# EAGLE design main2 (EAGLE 7.4.0)
Line-Tracking Robot Project
DATE: 2015/09/23; DESIGNER: iPAS; PROJECT: Line-Tracking Robot
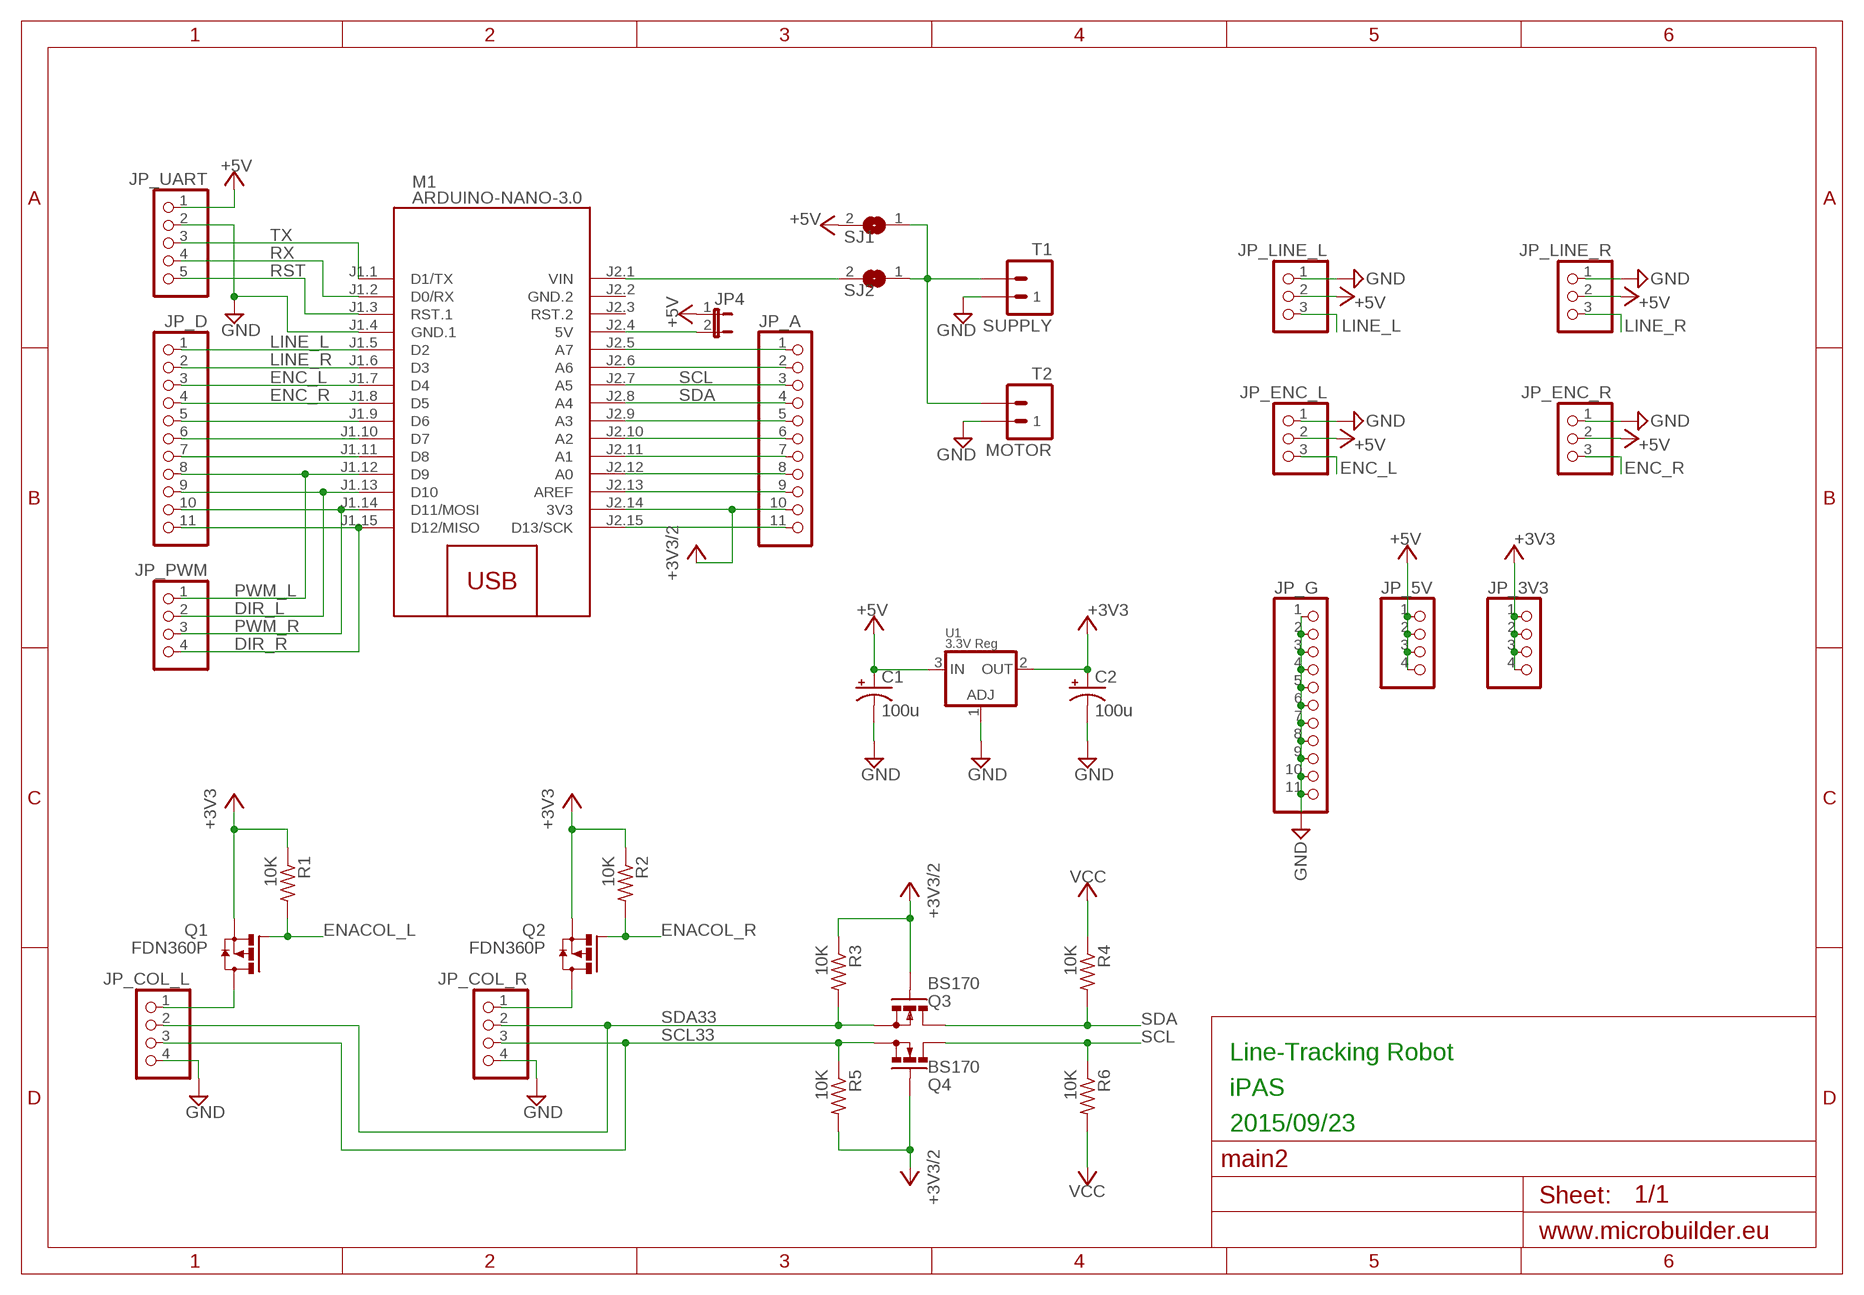
[diagram p0: schematic, sheet 1]

## Parts
C1  100u  RCL_CPOL-USE2.5-6  [RCL_E2,5-6]
C2  100u  RCL_CPOL-USE2.5-6  [RCL_E2,5-6]
JP4  JUMPER2  [JUMPER2]
JP_3V3  HEADER-1X4ROUND  [1X04_ROUND]
JP_5V  HEADER-1X4ROUND  [1X04_ROUND]
JP_A  HEADER-1X11  [1X11_ROUND]
JP_COL_L  HEADER-1X4ROUND  [1X04_ROUND]
JP_COL_R  HEADER-1X4ROUND  [1X04_ROUND]
JP_D  HEADER-1X11  [1X11_ROUND]
JP_ENC_L  HEADER-1X3ROUND  [1X03_ROUND]
JP_ENC_R  HEADER-1X3ROUND  [1X03_ROUND]
JP_G  HEADER-1X11  [1X11_ROUND]
JP_LINE_L  HEADER-1X3ROUND  [1X03_ROUND]
JP_LINE_R  HEADER-1X3ROUND  [1X03_ROUND]
JP_PWM  HEADER-1X4ROUND  [1X04_ROUND]
JP_UART  HEADER-1X5ROUND  [1X05_ROUND]
M1  ARDUINO-NANO-3.0  [ARDUINO-NANO-3.0]
Q1  FDN360P  [SUPER-SOT3]
Q2  FDN360P  [SUPER-SOT3]
Q3  BS170  [TO92-]
Q4  BS170  [TO92-]
R1  10K  RCL_R-US0204/5  [RCL_0204/5]
R2  10K  RCL_R-US0204/5  [RCL_0204/5]
R3  10K  RCL_R-US0204/5  [RCL_0204/5]
R4  10K  RCL_R-US0204/5  [RCL_0204/5]
R5  10K  RCL_R-US0204/5  [RCL_0204/5]
R6  10K  RCL_R-US0204/5  [RCL_0204/5]
SJ1  SOLDERJUMPERREFLOW  [SOLDERJUMPER_REFLOW]
SJ2  SOLDERJUMPERREFLOW  [SOLDERJUMPER_REFLOW]
T1  SUPPLY  ST02-3.81MM  [DG381-02P]
T2  MOTOR  ST02-3.81MM  [DG381-02P]
U1  3.3V Reg  LM1117SOT223-REFLOW  [SOT223-R]

## Nets
+3V3: C2.+ JP_3V3.1 JP_3V3.2 JP_3V3.3 JP_3V3.4 Q1.2(S) Q2.2(S) R1.1 R2.1 U1.2(OUT)
+3V3/2: JP_A.10 M1.J2.14(3V3) Q3.2(G) Q4.2(G) R3.1 R5.2
+5V: C1.+ JP4.1 JP_5V.1 JP_5V.2 JP_5V.3 JP_5V.4 JP_ENC_L.2 JP_ENC_R.2 JP_LINE_L.2 JP_LINE_R.2 JP_UART.1 SJ1.2 U1.3(IN)
DIR_L: JP_D.9 JP_PWM.2 M1.J1.13(D10)
DIR_R: JP_D.11 JP_PWM.4 M1.J1.15(D12/MISO)
ENACOL_L: Q1.1(G) R1.2
ENACOL_R: Q2.1(G) R2.2
ENC_L: JP_D.3 JP_ENC_L.3 M1.J1.7(D4)
ENC_R: JP_D.4 JP_ENC_R.3 M1.J1.8(D5)
GND: C1.- C2.- JP_COL_L.4 JP_COL_R.4 JP_ENC_L.1 JP_ENC_R.1 JP_G.1 JP_G.2 JP_G.3 JP_G.4 JP_G.5 JP_G.6 JP_G.7 JP_G.8 JP_G.9 JP_G.10 JP_G.11 JP_LINE_L.1 JP_LINE_R.1 JP_UART.2 M1.J1.4(GND.1) T1.1 T2.1 U1.1(ADJ)
LINE_L: JP_D.1 JP_LINE_L.3 M1.J1.5(D2)
LINE_R: JP_D.2 JP_LINE_R.3 M1.J1.6(D3)
N$1: JP_COL_R.1 Q2.3(D)
N$2: JP_A.1 M1.J2.5(A7)
N$3: JP_COL_L.1 Q1.3(D)
N$4: JP_A.2 M1.J2.6(A6)
N$5: JP4.2 M1.J2.4(5V)
N$6: M1.J2.1(VIN) SJ2.2
N$7: SJ1.1 SJ2.1 T1.2 T2.2
N$9: JP_D.5 M1.J1.9(D6)
N$10: JP_D.6 M1.J1.10(D7)
N$11: JP_D.7 M1.J1.11(D8)
N$18: JP_A.5 M1.J2.9(A3)
N$19: JP_A.6 M1.J2.10(A2)
N$20: JP_A.7 M1.J2.11(A1)
N$21: JP_A.8 M1.J2.12(A0)
N$22: JP_A.9 M1.J2.13(AREF)
N$24: JP_A.11 M1.J2.15(D13/SCK)
PWM_L: JP_D.8 JP_PWM.1 M1.J1.12(D9)
PWM_R: JP_D.10 JP_PWM.3 M1.J1.14(D11/MOSI)
RST: JP_UART.5 M1.J1.3(RST.1)
RX: JP_UART.4 M1.J1.2(D0/RX)
SCL: JP_A.3 M1.J2.7(A5) Q4.1(D) R6.1
SCL33: JP_COL_L.3 JP_COL_R.3 Q4.3(S) R5.1
SDA: JP_A.4 M1.J2.8(A4) Q3.1(D) R4.2
SDA33: JP_COL_L.2 JP_COL_R.2 Q3.3(S) R3.2
TX: JP_UART.3 M1.J1.1(D1/TX)
VCC: R4.1 R6.2
Unconnected: M1.J2.3(RST.2)

## Power pins joined to a net without a drawn wire
GND.2: M1.J2.2(GND.2)

## Library data of the parts
C1 C2 = ipas:RCL_CPOL-US: POLARIZED CAPACITOR, American symbol
JP4 = microbuilder:JUMPER2: JUMPER - 2 Pins
JP_3V3 JP_5V JP_COL_L JP_COL_R JP_PWM = microbuilder:HEADER-1X4: PIN HEADER
JP_A JP_D JP_G = microbuilder:HEADER-1X11
JP_ENC_L JP_ENC_R JP_LINE_L JP_LINE_R = microbuilder:HEADER-1X3: PIN HEADER
JP_UART = microbuilder:HEADER-1X5: PIN HEADER
M1 = diy-modules:ARDUINO-NANO-3.0: Arduino Nano 3.0
Q1 Q2 = transistor-power:FDN360P: Single P-Channel, PowerTrench (R) MOSFET Source: http://www.fairchildsemi.com/ds/FD/FDN360P.pdf
Q3 Q4 = ipas:BS170: N-CHANNEL MOS FET Small Signal MOSFET 500 mA, 60 Volts
R1-R6 = ipas:RCL_R-US: RESISTOR, American symbol
SJ1 SJ2 = ipas:SOLDERJUMPER: SMD Solder JUMPER Solder the two pads together to create a connection, or remove the solder to break it. REFLOW - Use this footprint for solder paste and reflow ovens. WAVE - Use this footprint for hand-soldering (larger pads). CLOSED - Has a trace between the two pads to ensure it is closed by default. The trace needs to be cut to disable the jumper, and can be closed again by creating a solder bridge between the two pads.
T1 T2 = ipas:ST02: Screw Terminal Block - 2 Way -5MM: EK500V series. Rated at 20A, 300VAC. Cable size: 2mm² Supplier: Altronics P2034A Source: http://www.dinkle.com/upfiles/proter21253708953.pdf -5.08MM: The back half of a EK500V4R-04P. Rated at 20A, 300VAC. Cable size: 2mm² Supplier: Altronics P2024 (half of) Source: http://www.dinkle.com/upfiles/proter21253708833.pdf -3.5MM: ED350V series. Rated at 10A, 300VAC. Cable size: 1.4mm² Supplier: Altronics P2028 Source: http://www.dinkle.com/upfiles/proter21253714491.pdf -3.81MM: DG381 series. Rated at 20A, 300VAC. Cable size: 1mm² Supplier: DEGSON
U1 = microbuilder:LM1117: LM1117 Voltage Regulator LM1117 Adjustable Voltage regulator [Digikey: LM1117IMP-ADJDKR-ND] LM1117 3.3V Voltage regulator [AP1117E33GDIDKR-ND] LM1117 5.0V Voltage regulator [AP1117E50GDIDKR-ND] SOT223-REFLOW - SOT223 package for solder paste/reflow ovens SOT223-WAVE - SOT223 package for hand-soldering (larger pads) Note: For the fixed-voltage regulators, simply set the ADJ pin to GND.

## Board
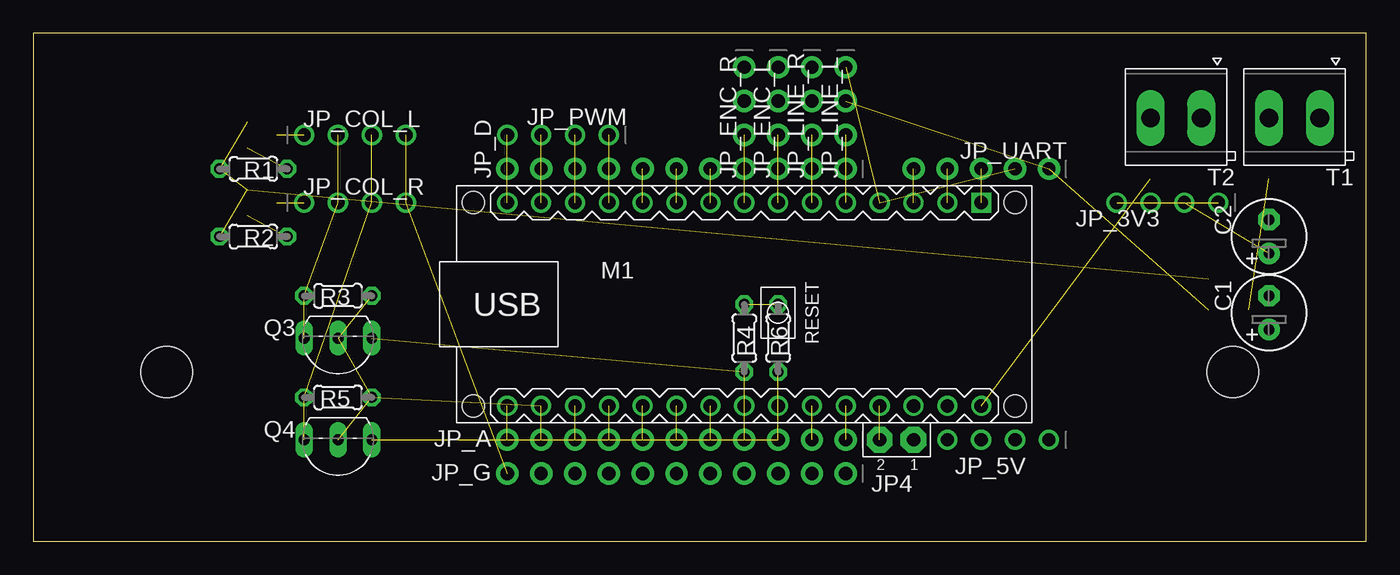
[diagram p1: board, top side]
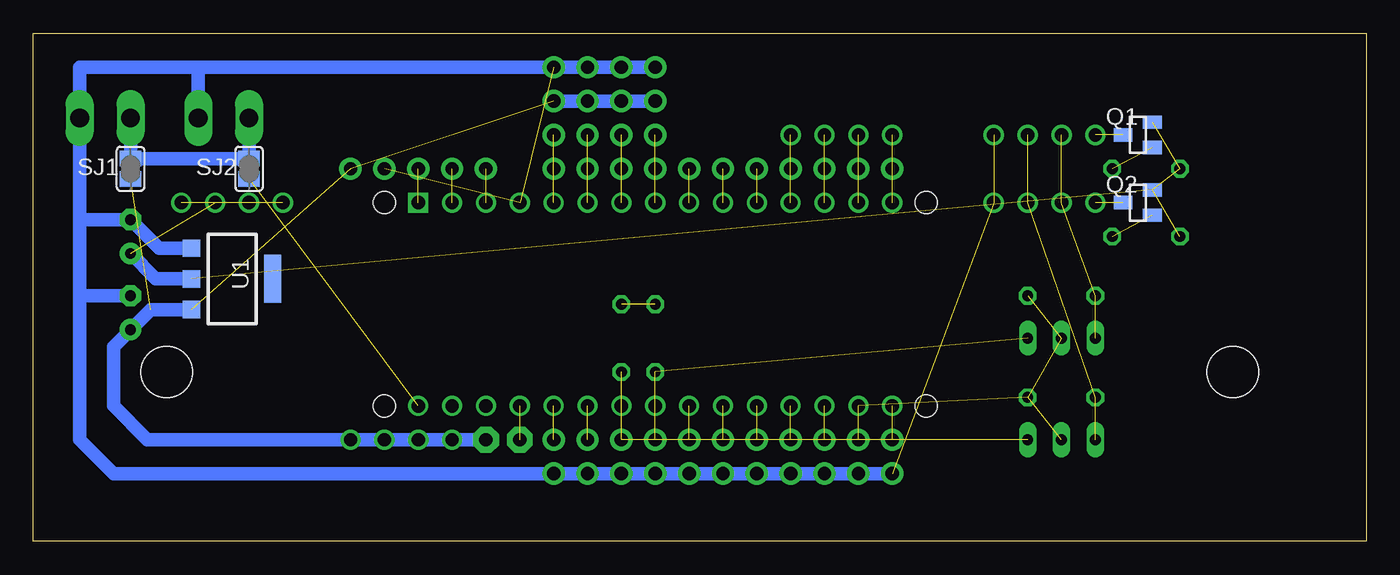
[diagram p2: board, bottom side, seen from below]

Size 100 x 38.1 mm. Coordinates in mm from the lower left corner, seen from the top.
Outline: 0,0 100,0 100,38.1 0,38.1 0,0
Copper layers (1*16): Top 0.035mm / dielectric 1.5mm / Bottom 0.035mm
Design rules "default": minimum track width 10mil, minimum drill 24mil, track to track 8mil, track to pad 8mil, pad to pad 8mil, via to via 8mil, smd to smd 8mil, copper to edge 40mil, drill to drill 8mil, minimum pad ring 10mil, minimum via ring 8mil, stop-mask expansion 4mil, vias tented up to drill 0mil, thermal gap 10mil
Holes 3.86 mm at 90,12.7 10,12.7

### Footprints (pad centres in the part's own frame; a part is rotated, then mirrored left to right if it is on the bottom)
RCL_E2,5-6 = drill 0.813 pad 1.6: + -1.27,0 | drill 0.813 pad 1.6 octagon: - 1.27,0
JUMPER2 = drill 1 pad 1.93 octagon: 1 2.54,0; 2 0,0
1X04_ROUND = drill 1 pad 1.524: 1 -3.81,0; 2 -1.27,0; 3 1.27,0; 4 3.81,0
1X11_ROUND = drill 1 pad 1.676: 1 -12.7,0; 2 -10.16,0; 3 -7.62,0; 4 -5.08,0; 5 -2.54,0; 6 0,0; 7 2.54,0; 8 5.08,0; 9 7.62,0; 10 10.16,0; 11 12.7,0
1X03_ROUND = drill 1 pad 1.676: 1 -2.54,0; 2 0,0; 3 2.54,0
1X05_ROUND = drill 1 pad 1.676: 1 -5.08,0; 2 -2.54,0; 3 0,0; 4 2.54,0; 5 5.08,0
ARDUINO-NANO-3.0 = drill 1 square: J1.1 17.78,7.62 | drill 1: J1.2 15.24,7.62; J1.3 12.7,7.62; J1.4 10.16,7.62; J1.5 7.62,7.62; J1.6 5.08,7.62; J1.7 2.54,7.62; J1.8 0,7.62; J1.9 -2.54,7.62; J1.10 -5.08,7.62; J1.11 -7.62,7.62; J1.12 -10.16,7.62; J1.13 -12.7,7.62; J1.14 -15.24,7.62; J1.15 -17.78,7.62; J2.1 17.78,-7.62; J2.2 15.24,-7.62; J2.3 12.7,-7.62; J2.4 10.16,-7.62; J2.5 7.62,-7.62; J2.6 5.08,-7.62; J2.7 2.54,-7.62; J2.8 0,-7.62; J2.9 -2.54,-7.62; J2.10 -5.08,-7.62; J2.11 -7.62,-7.62; J2.12 -10.16,-7.62; J2.13 -12.7,-7.62; J2.14 -15.24,-7.62; J2.15 -17.78,-7.62 | hole 1.651: -20.32,7.62; -20.32,-7.62; 20.32,-7.62; 20.32,7.62
SUPER-SOT3 = smd 1 x 1.4: 1 -0.95,-1.1; 2 0.95,-1.1; 3 0,1.1
TO92- = drill 0.813 long: 1 -2.54,0; 2 0,0; 3 2.54,0
RCL_0204/5 = drill 0.813 octagon: 1 -2.54,0; 2 2.54,0
SOLDERJUMPER_REFLOW = smd 1.168 x 1.6: 1 -0.762,0; 2 0.762,0
DG381-02P = drill 1.4 long: 1 -3.81,0; 2 0,0
SOT223-R = smd 1.3 x 1.3: 1 -2.3,-3.05; 2 0,-3.05; 3 2.3,-3.05 | smd 3.6 x 1.3: 4 0,3.05

### Placement (x,y rotation side)
C1  92.71,17.14 90 top
C2  92.71,22.86 90 top
JP4  63.5,7.62 0 top
JP_3V3  85.09,25.4 180 top
JP_5V  72.39,7.62 180 top
JP_A  48.26,7.62 180 top
JP_COL_L  24.13,30.48 0 top
JP_COL_R  24.13,25.4 0 top
JP_D  48.26,27.94 180 top
JP_ENC_L  55.88,33.02 270 top
JP_ENC_R  53.34,33.02 270 top
JP_G  48.26,5.08 180 top
JP_LINE_L  60.96,33.02 270 top
JP_LINE_R  58.42,33.02 270 top
JP_PWM  39.37,30.48 180 top
JP_UART  71.12,27.94 180 top
M1  53.34,17.78 0 top
Q1  17.14,30.48 90 bottom
Q2  17.14,25.4 90 bottom
Q3  22.86,15.24 180 top
Q4  22.86,7.62 180 top
R1  16.51,27.94 0 top
R2  16.51,22.86 0 top
R3  22.86,18.41 180 top
R4  53.34,15.24 270 top
R5  22.86,10.79 0 top
R6  55.88,15.24 90 top
SJ1  92.71,27.94 270 bottom
SJ2  83.82,27.94 270 bottom
T1  92.71,31.75 180 top
T2  83.82,31.75 180 top
U1  85.09,19.68 270 bottom

### Tracks (layer width: path | path; a pad name or v marks a point on that pad's centre or on a via)
+3V3  (8 unrouted)
  Bottom 1.016: U1.2 90.81,19.68 C2.+
+3V3/2  (5 unrouted)
+5V  (3 unrouted)
  Bottom 1.016: U1.3 91.2,17.39 C1.+ 93.98,14.61 93.98,10.16 91.44,7.62 JP_5V.1 JP_5V.2 JP_5V.3 JP_5V.4 JP4.1 | JP_LINE_L.2 JP_LINE_R.2 JP_ENC_L.2 JP_ENC_R.2
DIR_L  (2 unrouted)
DIR_R  (2 unrouted)
ENACOL_L  (1 unrouted)
ENACOL_R  (1 unrouted)
ENC_L  (2 unrouted)
ENC_R  (2 unrouted)
GND  (4 unrouted)
  Bottom 1.016: 87.63,35.56 96.52,35.56 T1.1 96.52,24.13 | T2.1 87.63,35.56 | U1.1 90.56,21.98 C2.- 96.52,24.13 | 96.52,24.13 96.52,18.41 | 96.52,18.41 96.52,7.62 93.98,5.08 JP_G.1 JP_G.2 JP_G.3 JP_G.4 JP_G.5 JP_G.6 JP_G.7 JP_G.8 JP_G.9 JP_G.10 JP_G.11 | C1.- 96.52,18.41 | 87.63,35.56 JP_LINE_L.1 JP_LINE_R.1 JP_ENC_L.1 JP_ENC_R.1
LINE_L  (2 unrouted)
LINE_R  (2 unrouted)
N$1  (1 unrouted)
N$2  (1 unrouted)
N$3  (1 unrouted)
N$4  (1 unrouted)
N$5  (1 unrouted)
N$6  (1 unrouted)
N$7
  Bottom 1.016: T1.2 SJ1.1 SJ2.1 T2.2
N$9  (1 unrouted)
N$10  (1 unrouted)
N$11  (1 unrouted)
N$18  (1 unrouted)
N$19  (1 unrouted)
N$20  (1 unrouted)
N$21  (1 unrouted)
N$22  (1 unrouted)
N$24  (1 unrouted)
PWM_L  (2 unrouted)
PWM_R  (2 unrouted)
RST  (1 unrouted)
RX  (1 unrouted)
SCL  (3 unrouted)
SCL33  (3 unrouted)
SDA  (3 unrouted)
SDA33  (3 unrouted)
TX  (1 unrouted)
VCC  (1 unrouted)